# Altium schematic sheet 13 HDMI.SchDoc
size 420 x 297 mm
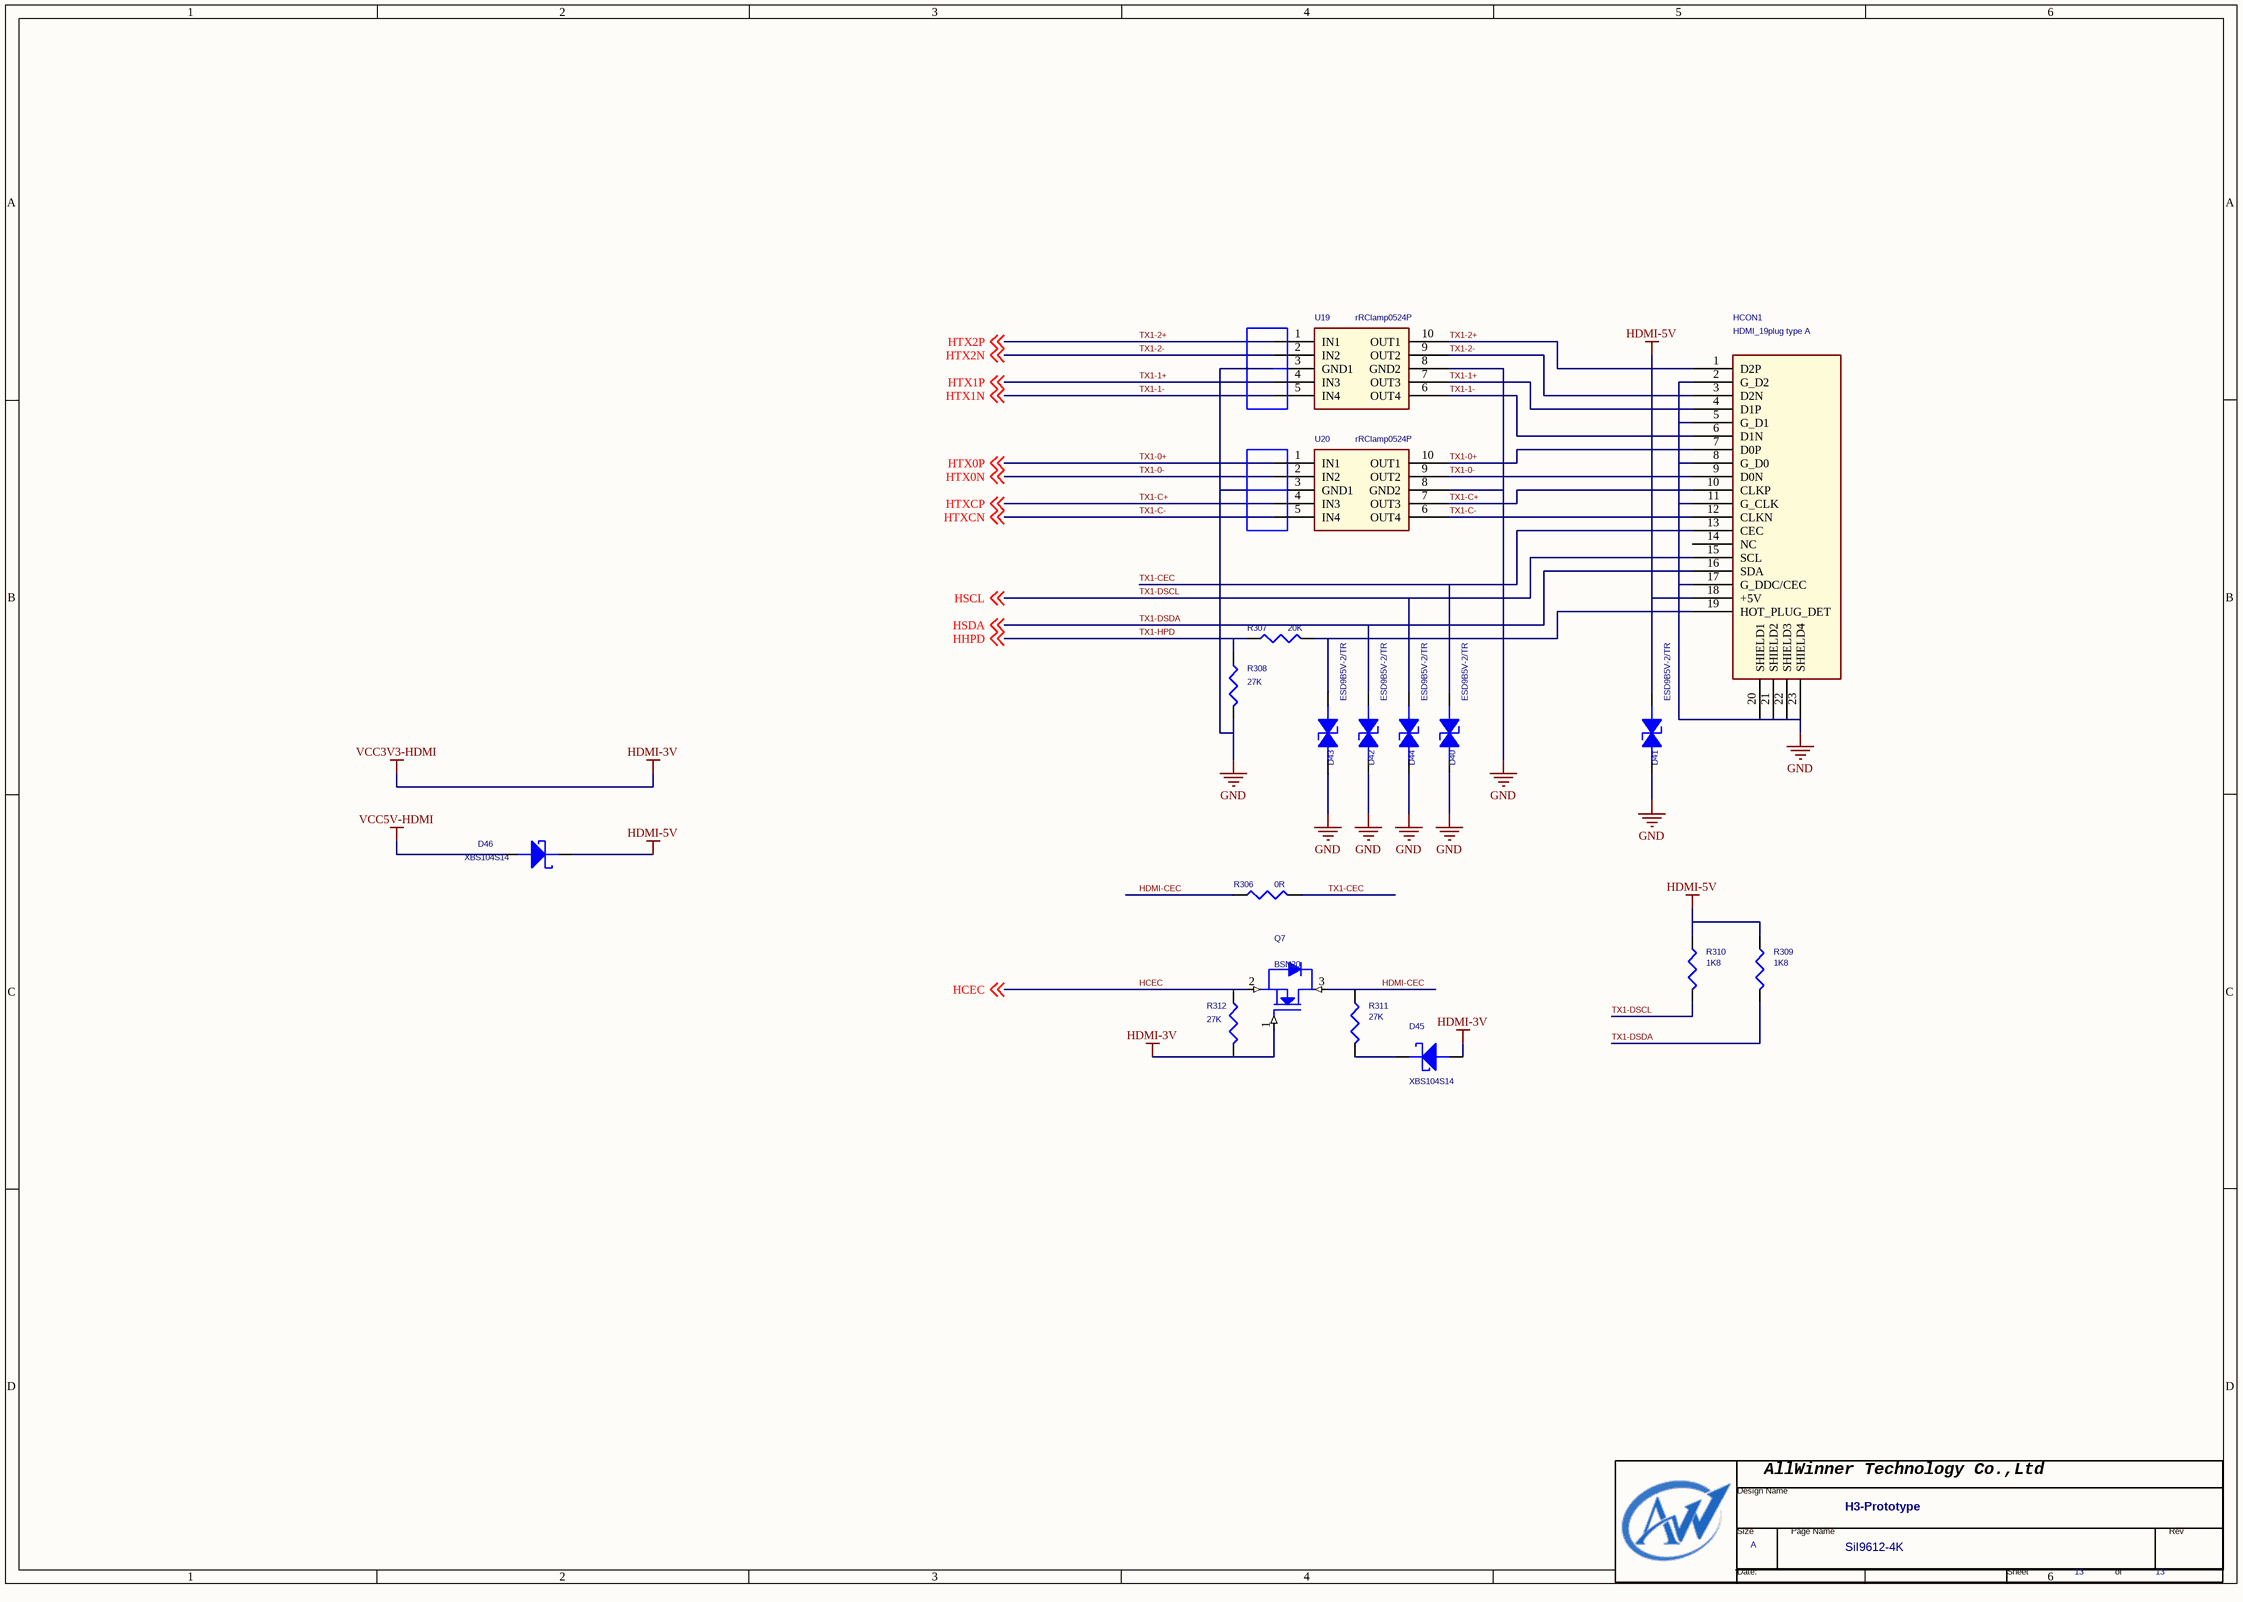
[diagram p0: 13 HDMI.SchDoc]

## Parts
*  Page Count: 13  Page Size: A  Title: H3-Prototype  Doc: SiI9612-4K  (hidden comment: TitleBlock0-AW)  (graphical)
D40  ESD9B5V-2/TR  [C0402]
D41  ESD9B5V-2/TR  [C0402]
D42  ESD9B5V-2/TR  [C0402]
D43  ESD9B5V-2/TR  [C0402]
D44  ESD9B5V-2/TR  [C0402]
D45  XBS104S14  [SOD123]
D46  XBS104S14  [SOD123]
HCON1  HDMI_19plug type A  [HDMI]
Q7  BSN20  [sot-23]
R306  0R  [R0402]
R307  20K  [R0402]
R308  27K  [R0402]
R309  1K8  [R0402]
R310  1K8  [R0402]
R311  27K  [R0402]
R312  27K  [R0402]
U19  rRClamp0524P  [RCLAMP0524P]
U20  rRClamp0524P  [RCLAMP0524P]

## Nets
GND: D40.2(CATHODE) D41.2(CATHODE) D42.2(CATHODE) D43.2(CATHODE) D44.2(CATHODE) HCON1.2(G_D2) HCON1.5(G_D1) HCON1.8(G_D0) HCON1.11(G_CLK) HCON1.17(G_DDC/CEC) HCON1.20(SHIELD1) HCON1.21(SHIELD2) HCON1.22(SHIELD3) HCON1.23(SHIELD4) R308.2 U19.3(GND1) U19.8(GND2) U20.3(GND1) U20.8(GND2)
HDMI-3V: D45.A Q7.1(GATE) R312.2  [also labelled VCC3V3-HDMI]
HDMI-5V: D41.1(ANODE) D46.C HCON1.18(+5V) R309.2 R310.2
VCC5V-HDMI: D46.A
HCEC: Q7.2(SOURCE) R312.1 ; off-sheet HCEC
HDMI-CEC: Q7.3(DRAIN) R306.2 R311.2
TX1-0+: HCON1.7(D0P) U20.1(IN1) U20.10(OUT1) ; off-sheet HTX0P  [also labelled HTX0P]
TX1-0-: HCON1.9(D0N) U20.2(IN2) U20.9(OUT2) ; off-sheet HTX0N  [also labelled HTX0N]
TX1-1+: HCON1.4(D1P) U19.4(IN3) U19.7(OUT3) ; off-sheet HTX1P  [also labelled HTX1P]
TX1-1-: HCON1.6(D1N) U19.5(IN4) U19.6(OUT4) ; off-sheet HTX1N  [also labelled HTX1N]
TX1-2+: HCON1.1(D2P) U19.1(IN1) U19.10(OUT1) ; off-sheet HTX2P  [also labelled HTX2P]
TX1-2-: HCON1.3(D2N) U19.2(IN2) U19.9(OUT2) ; off-sheet HTX2N  [also labelled HTX2N]
TX1-C+: HCON1.10(CLKP) U20.4(IN3) U20.7(OUT3) ; off-sheet HTXCP  [also labelled HTXCP]
TX1-C-: HCON1.12(CLKN) U20.5(IN4) U20.6(OUT4) ; off-sheet HTXCN  [also labelled HTXCN]
TX1-CEC: D40.1(ANODE) HCON1.13(CEC) R306.1
TX1-DSCL: D44.1(ANODE) HCON1.15(SCL) R310.1 ; off-sheet HSCL  [also labelled HSCL]
TX1-DSDA: D42.1(ANODE) HCON1.16(SDA) R309.1 ; off-sheet HSDA  [also labelled HSDA]
TX1-HPD: R307.1 R308.1 ; off-sheet HHPD  [also labelled HHPD]
NetD43_1: D43.1(ANODE) HCON1.19(HOT_PLUG_DET) R307.2
NetD45_C: D45.C R311.1

Not connected (* = marked no-connect by the designer): HCON1 14(NC)

## Notes on the sheet
- (in symbol TitleBlock0-AW) AllWinner Technology Co.,Ltd; Design Name; Size; Page Name; Rev; Date:; Sheet; of

## Library data of the parts
D40-D44 = 1_1.5KE100A_Dup1: 1ST PART DESCRIPTION: WILL ESD9B5V Bidirection ESD Protection
D45 = DIODE_SCHOTTKY_1
D46 = DIODE_SCHOTTKY_2
HCON1 = HDMI19_PLUG
Q7 = NMOS_0
R306 R309-R312 = RESISTOR
R307 = R_Dup1
R308 = RESISTOR_Dup2
* = TitleBlock0-AW: Page Number: 13; Page Create Date: March  8, 1995